# Altium schematic sheet Connector.SchDoc
size A4; SheetNumber: 3; SheetTotal: 3
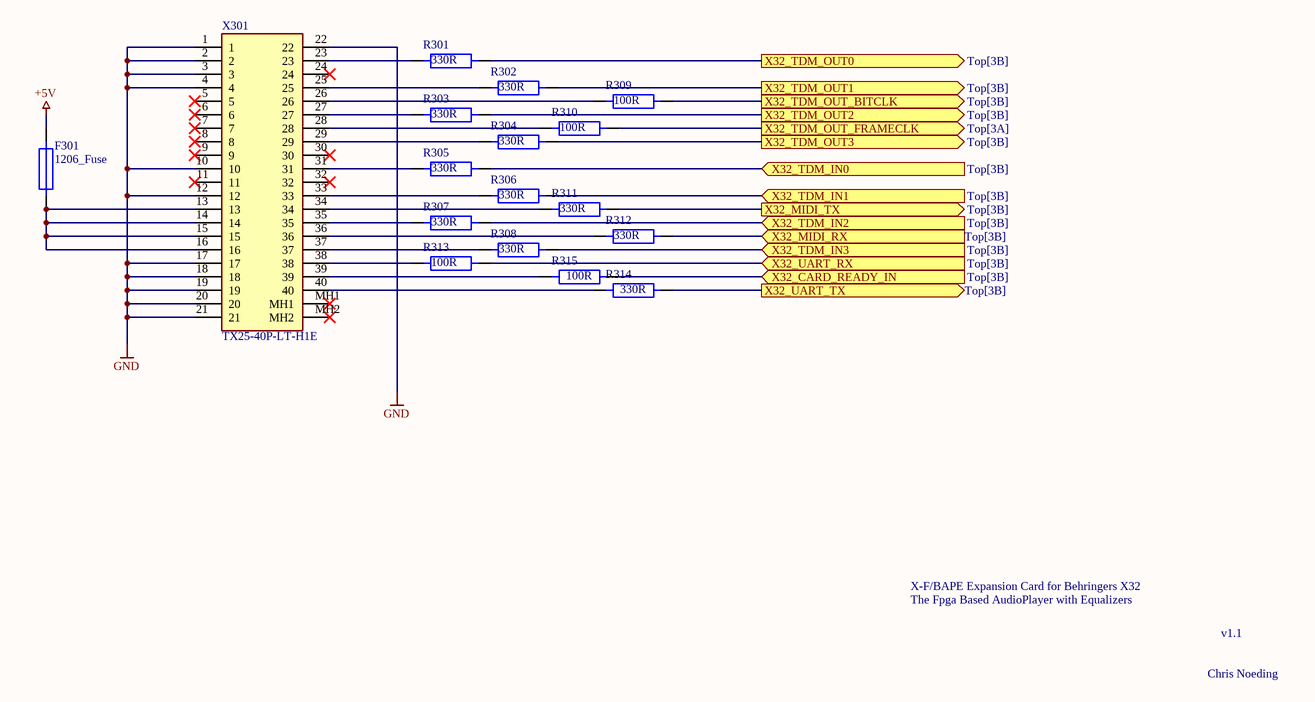
[diagram p0: Connector.SchDoc]

## Parts
F301  1206_Fuse  [1206]
R301  330R  [1206]
R302  330R  [1206]
R303  330R  [1206]
R304  330R  [1206]
R305  330R  [1206]
R306  330R  [1206]
R307  330R  [1206]
R308  330R  [1206]
R309  100R  [1206]
R310  100R  [1206]
R311  330R  [1206]
R312  330R  [1206]
R313  100R  [1206]
R314  330R  [1206]
R315  100R  [1206]
X301  TX25-40P-LT-H1E  [TX2540PLTH1E]

## Ports
X32_CARD_READY_IN (in, see Top[3B]), X32_MIDI_RX (in, see Top[3B]), X32_MIDI_TX (out, see Top[3B]), X32_TDM_IN0 (in, see Top[3B]), X32_TDM_IN1 (in, see Top[3B]), X32_TDM_IN2 (in, see Top[3B]), X32_TDM_IN3 (in, see Top[3B]), X32_TDM_OUT0 (out, see Top[3B]), X32_TDM_OUT1 (out, see Top[3B]), X32_TDM_OUT2 (out, see Top[3B]), X32_TDM_OUT3 (out, see Top[3B]), X32_TDM_OUT_BITCLK (out, see Top[3B]), X32_TDM_OUT_FRAMECLK (out, see Top[3A]), X32_UART_RX (in, see Top[3B]), X32_UART_TX (out, see Top[3B])

## Nets
+5V: F301.2
GND: X301.1 X301.2 X301.3 X301.4 X301.10 X301.12 X301.17 X301.18 X301.19 X301.20 X301.21 X301.22
X32_CARD_READY_IN: R315.2 ; port X32_CARD_READY_IN
X32_MIDI_RX: R312.2 ; port X32_MIDI_RX
X32_MIDI_TX: R311.2 ; port X32_MIDI_TX
X32_TDM_IN0: R305.2 ; port X32_TDM_IN0
X32_TDM_IN1: R306.2 ; port X32_TDM_IN1
X32_TDM_IN2: R307.2 ; port X32_TDM_IN2
X32_TDM_IN3: R308.2 ; port X32_TDM_IN3
X32_TDM_OUT0: R301.2 ; port X32_TDM_OUT0
X32_TDM_OUT1: R302.2 ; port X32_TDM_OUT1
X32_TDM_OUT2: R303.2 ; port X32_TDM_OUT2
X32_TDM_OUT3: R304.2 ; port X32_TDM_OUT3
X32_TDM_OUT_BITCLK: R309.2 ; port X32_TDM_OUT_BITCLK
X32_TDM_OUT_FRAMECLK: R310.2 ; port X32_TDM_OUT_FRAMECLK
X32_UART_RX: R313.2 ; port X32_UART_RX
X32_UART_TX: R314.2 ; port X32_UART_TX
NetF301_1: F301.1 X301.13 X301.14 X301.15 X301.16
NetR301_1: R301.1 X301.23
NetR302_1: R302.1 X301.25
NetR303_1: R303.1 X301.27
NetR304_1: R304.1 X301.29
NetR305_1: R305.1 X301.31
NetR306_1: R306.1 X301.33
NetR307_1: R307.1 X301.35
NetR308_1: R308.1 X301.37
NetR309_1: R309.1 X301.26
NetR310_1: R310.1 X301.28
NetR311_1: R311.1 X301.34
NetR312_1: R312.1 X301.36
NetR313_1: R313.1 X301.38
NetR314_1: R314.1 X301.40
NetR315_1: R315.1 X301.39

Not connected (* = marked no-connect by the designer): X301 5* 6* 7* 8* 9* 11* 24* 30* 32* MH1* MH2*

## Notes on the sheet
- X-F/BAPE Expansion Card for Behringers X32
- The Fpga Based AudioPlayer with Equalizers
- v1.1
- Chris Noeding

## Library data of the parts
R301-R315 = 1206_R: SMA-ArtikelNr: *
X301 = TX25-40P-LT-H1E: Connector; Manufacturer_Name: JAE; Datasheet Link: https://www.jae.com/direct/topics/topics_file_download/topics_id=66792&ext_no=06&_lang=en&v=; Height: 9.2mm; Manufacturer_Part_Number: TX25-40P-LT-H1E; Mouser Part Number: 656-TX25-40P-LT-H1E; Mouser Price/Stock: https://www.mouser.co.uk/ProductDetail/JAE-Electronics/TX25-40P-LT-H1E?qs=v6Q0fmNAKahRjvRadE7n5w%3D%3D
F301 = 1206_Fuse: SMA-ArtikelNr: *